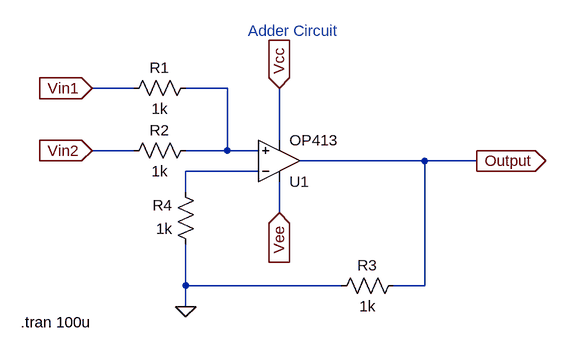
[diagram p0: schematic Adder.asc]
Adder.asc, the LTspice schematic file:
Version 4
SHEET 1 880 680
WIRE -176 -48 -240 -48
WIRE -32 -48 -96 -48
WIRE 48 32 48 -48
WIRE -176 48 -240 48
WIRE -32 48 -32 -48
WIRE -32 48 -96 48
WIRE 16 48 -32 48
WIRE 272 64 80 64
WIRE 352 64 272 64
WIRE 16 80 -96 80
WIRE -96 112 -96 80
WIRE 48 144 48 96
WIRE -96 256 -96 192
WIRE 144 256 -96 256
WIRE 272 256 272 64
WIRE 272 256 224 256
WIRE -96 288 -96 256
FLAG -96 288 0
FLAG 352 64 Output
IOPIN 352 64 Out
FLAG -240 -48 Vin1
IOPIN -240 -48 In
FLAG -240 48 Vin2
IOPIN -240 48 In
FLAG 48 -48 Vcc
IOPIN 48 -48 In
FLAG 48 144 Vee
IOPIN 48 144 In
SYMBOL res -80 -64 R90
WINDOW 0 0 56 VBottom 2
WINDOW 3 32 56 VTop 2
SYMATTR InstName R1
SYMATTR Value 1k
SYMBOL res -80 32 R90
WINDOW 0 0 56 VBottom 2
WINDOW 3 32 56 VTop 2
SYMATTR InstName R2
SYMATTR Value 1k
SYMBOL res 240 240 R90
WINDOW 0 0 56 VBottom 2
WINDOW 3 32 56 VTop 2
SYMATTR InstName R3
SYMATTR Value 1k
SYMBOL res -80 208 R180
WINDOW 0 36 76 Left 2
WINDOW 3 36 40 Left 2
SYMATTR InstName R4
SYMATTR Value 1k
SYMBOL OpAmps\\OP413 48 128 M180
SYMATTR InstName U1
TEXT 0 -136 Left 2 ;Adder Circuit
TEXT -350 312 Left 2 !.tran 100u

The netlist it stands for:
* Adder.asc
R1 N001 Vin1 1k
R2 N001 Vin2 1k
R3 Output 0 1k
R4 0 N002 1k
XU1 N001 N002 Vee Vcc Output OP413  ; pins In+ In- V+ V- OUT
* Adder Circuit
.tran 100u
.backanno
.end